# Altium schematic sheet Sheet4.SchDoc
size A4; SheetNumber: 4; SheetTotal: 4
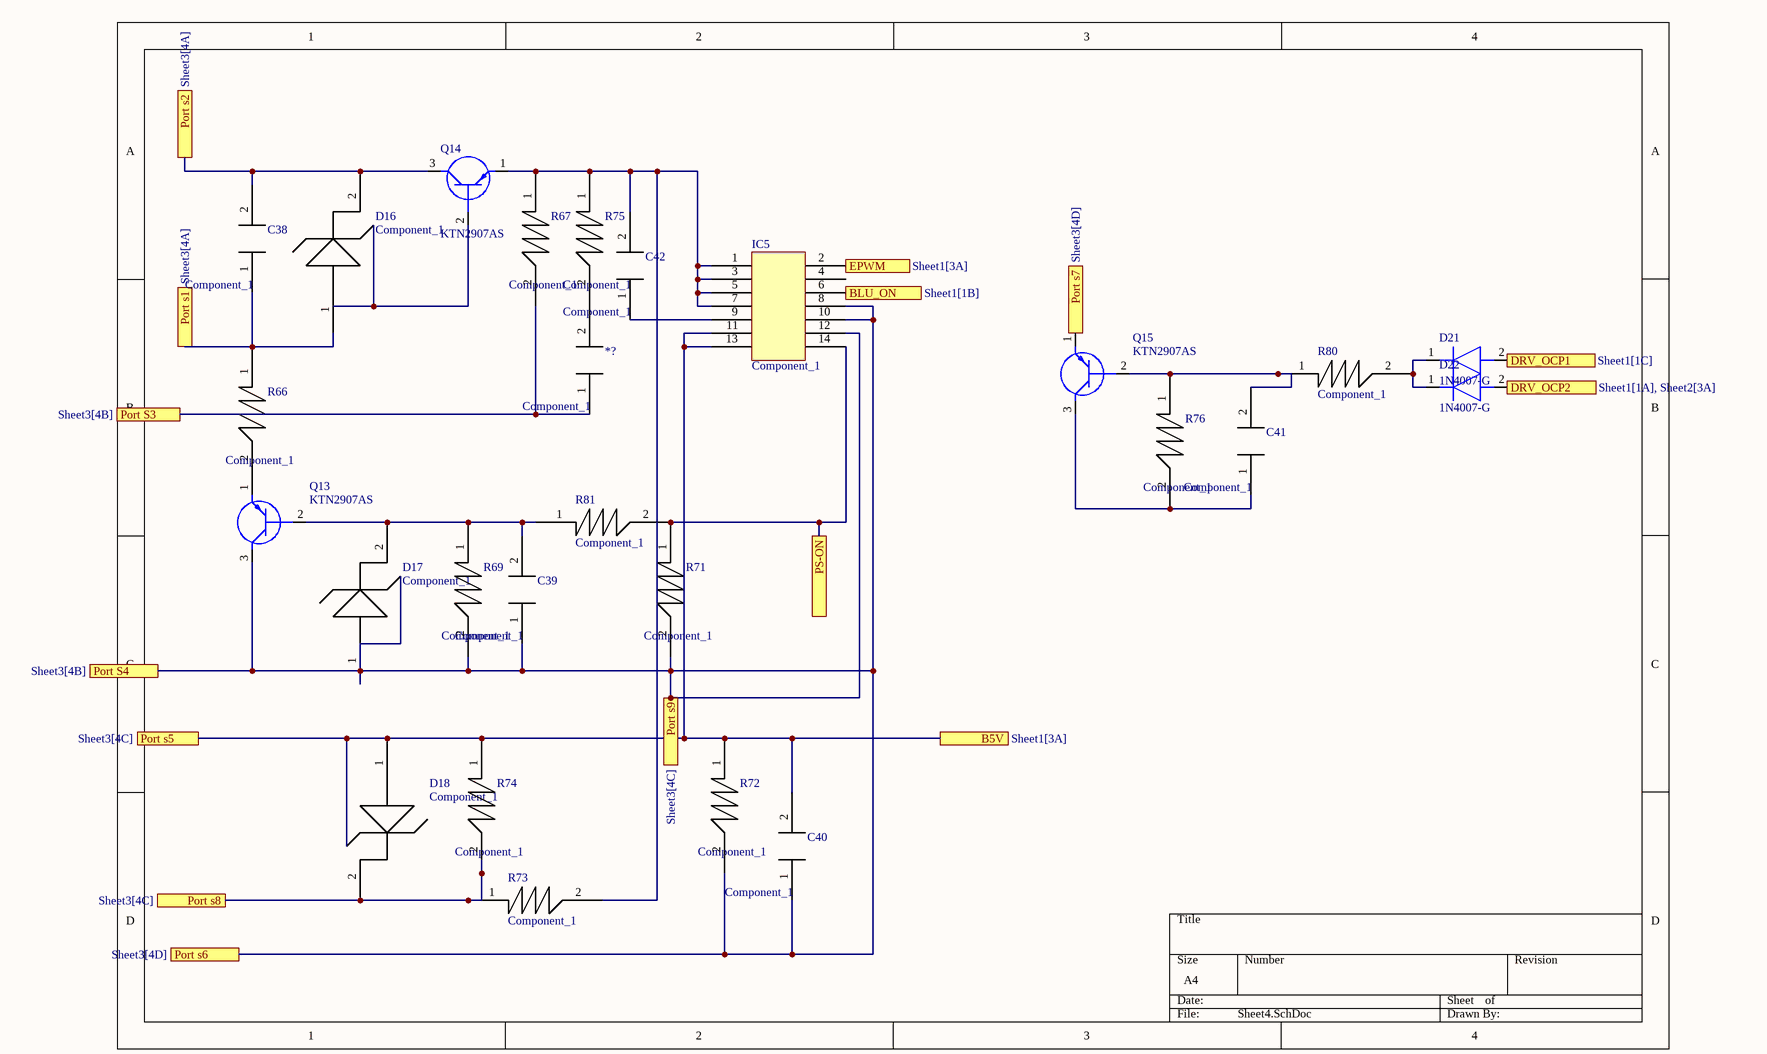
[diagram p0: Sheet4.SchDoc]

## Parts
*?  Component_1  [PCBComponent_1]
C38  Component_1  [PCBComponent_1]
C39  Component_1  [PCBComponent_1]
C40  Component_1  [PCBComponent_1]
C41  Component_1  [PCBComponent_1]
C42  Component_1  [PCBComponent_1]
D16  Component_1
D17  Component_1
D18  Component_1
D21  1N4007-G  [DIOAD1410W90L470D235]
D22  1N4007-G  [DIOAD1410W90L470D235]
IC5  Component_1  [PCBComponent_1]
Q13  KTN2907AS  [SOT95P245X130-3N]
Q14  KTN2907AS  [SOT95P245X130-3N]
Q15  KTN2907AS  [SOT95P245X130-3N]
R66  Component_1  [PCBComponent_1]
R67  Component_1  [PCBComponent_1]
R69  Component_1  [PCBComponent_1]
R71  Component_1  [PCBComponent_1]
R72  Component_1  [PCBComponent_1]
R73  Component_1  [PCBComponent_1]
R74  Component_1  [PCBComponent_1]
R75  Component_1  [PCBComponent_1]
R76  Component_1  [PCBComponent_1]
R80  Component_1  [PCBComponent_1]
R81  Component_1  [PCBComponent_1]

## Ports
B5V (see Sheet1[3A]), BLU_ON (see Sheet1[1B]), DRV_OCP1 (see Sheet1[1C]), DRV_OCP2 (see Sheet1[1A], Sheet2[3A]), EPWM (see Sheet1[3A]), Port s1 (see Sheet3[4A]), Port s2 (see Sheet3[4A]), Port S3 (see Sheet3[4B]), Port S4 (see Sheet3[4B]), Port s5 (see Sheet3[4C]), Port s6 (see Sheet3[4D]), Port s7 (see Sheet3[4D]), Port s8 (see Sheet3[4C]), Port s9 (see Sheet3[4C]), PS-ON

## Nets
B5V: C40.2 D18.1 IC5.11 IC5.13 R72.1 R74.1 ; port Port s5, port B5V
BLU_ON: IC5.6 ; port BLU_ON
DRV_OCP1: D21.2(A) ; port DRV_OCP1
DRV_OCP2: D22.2(A) ; port DRV_OCP2
EPWM: IC5.2 ; port EPWM
Port s1: C38.1 D16.1 R66.1 ; port Port s1
Port s2: C38.2 D16.2 Q14.3(C) ; port Port s2
Port S3: *?.1 R67.2 ; port Port S3
Port S4: C39.1 C40.1 D17.1 IC5.8 IC5.10 IC5.12 Q13.3(C) R69.2 R71.2 R72.2 ; port Port S4, port Port s9, port Port s6
Port s7: Q15.1(E) ; port Port s7
Port s8: D18.2 R73.1 R74.2 ; port Port s8
PS-ON: IC5.14 R71.1 R81.2 ; port PS-ON
Net*?_2: *?.2 R75.2
NetC39_2: C39.2 D17.2 Q13.2(B) R69.1 R81.1
NetC41_1: C41.1 Q15.3(C) R76.2
NetC41_2: C41.2 Q15.2(B) R76.1 R80.1
NetC42_1: C42.1 IC5.9
NetC42_2: C42.2 IC5.1 IC5.3 IC5.5 IC5.7 Q14.1(E) R67.1 R73.2 R75.1
NetD21_1: D21.1(K) D22.1(K) R80.2
NetQ13_1: Q13.1(E) R66.2

Not connected (* = marked no-connect by the designer): IC5 4; Q14 2(B)

## Library data of the parts
D21 D22 = 1N4007-G: Diode; Manufacturer_Name: Comchip Technology; Datasheet Link: https://datasheet.datasheetarchive.com/originals/distributors/Datasheets-DGA23/1390217.pdf; Manufacturer_Part_Number: 1N4007-G; Mouser Part Number: 750-1N4007-G; Mouser Price/Stock: https://www.mouser.co.uk/ProductDetail/Comchip-Technology/1N4007-G?qs=2qJf6qQ4IOKzApuByvlhjQ%3D%3D; Arrow Part Number: 1N4007-G; Arrow Price/Stock: https://www.arrow.com/en/products/1n4007-g/comchip-technology?region=nac
Q13-Q15 = KTN2907AS: Transistor BJT PNP; Manufacturer_Name: KEC; Datasheet Link: https://4donline.ihs.com/images/VipMasterIC/IC/KECC/KECC-S-A0011628695/KECC-S-A0011628695-1.pdf?hkey=EF798316E3902B6ED9A73243A3159BB0; Height: 1.3mm; Manufacturer_Part_Number: KTN2907AS